# Altium schematic sheet CONTROL-LECTURA.SchDoc: CONTROL - LECTURA
size A3; ApprovedBy: ---; Author: MARIO DE MIGUEL; Engineer: MARIO DE MIGUEL; SheetNumber: 2; SheetTotal: 7; ProjectTitle: SENSACIONAL 2
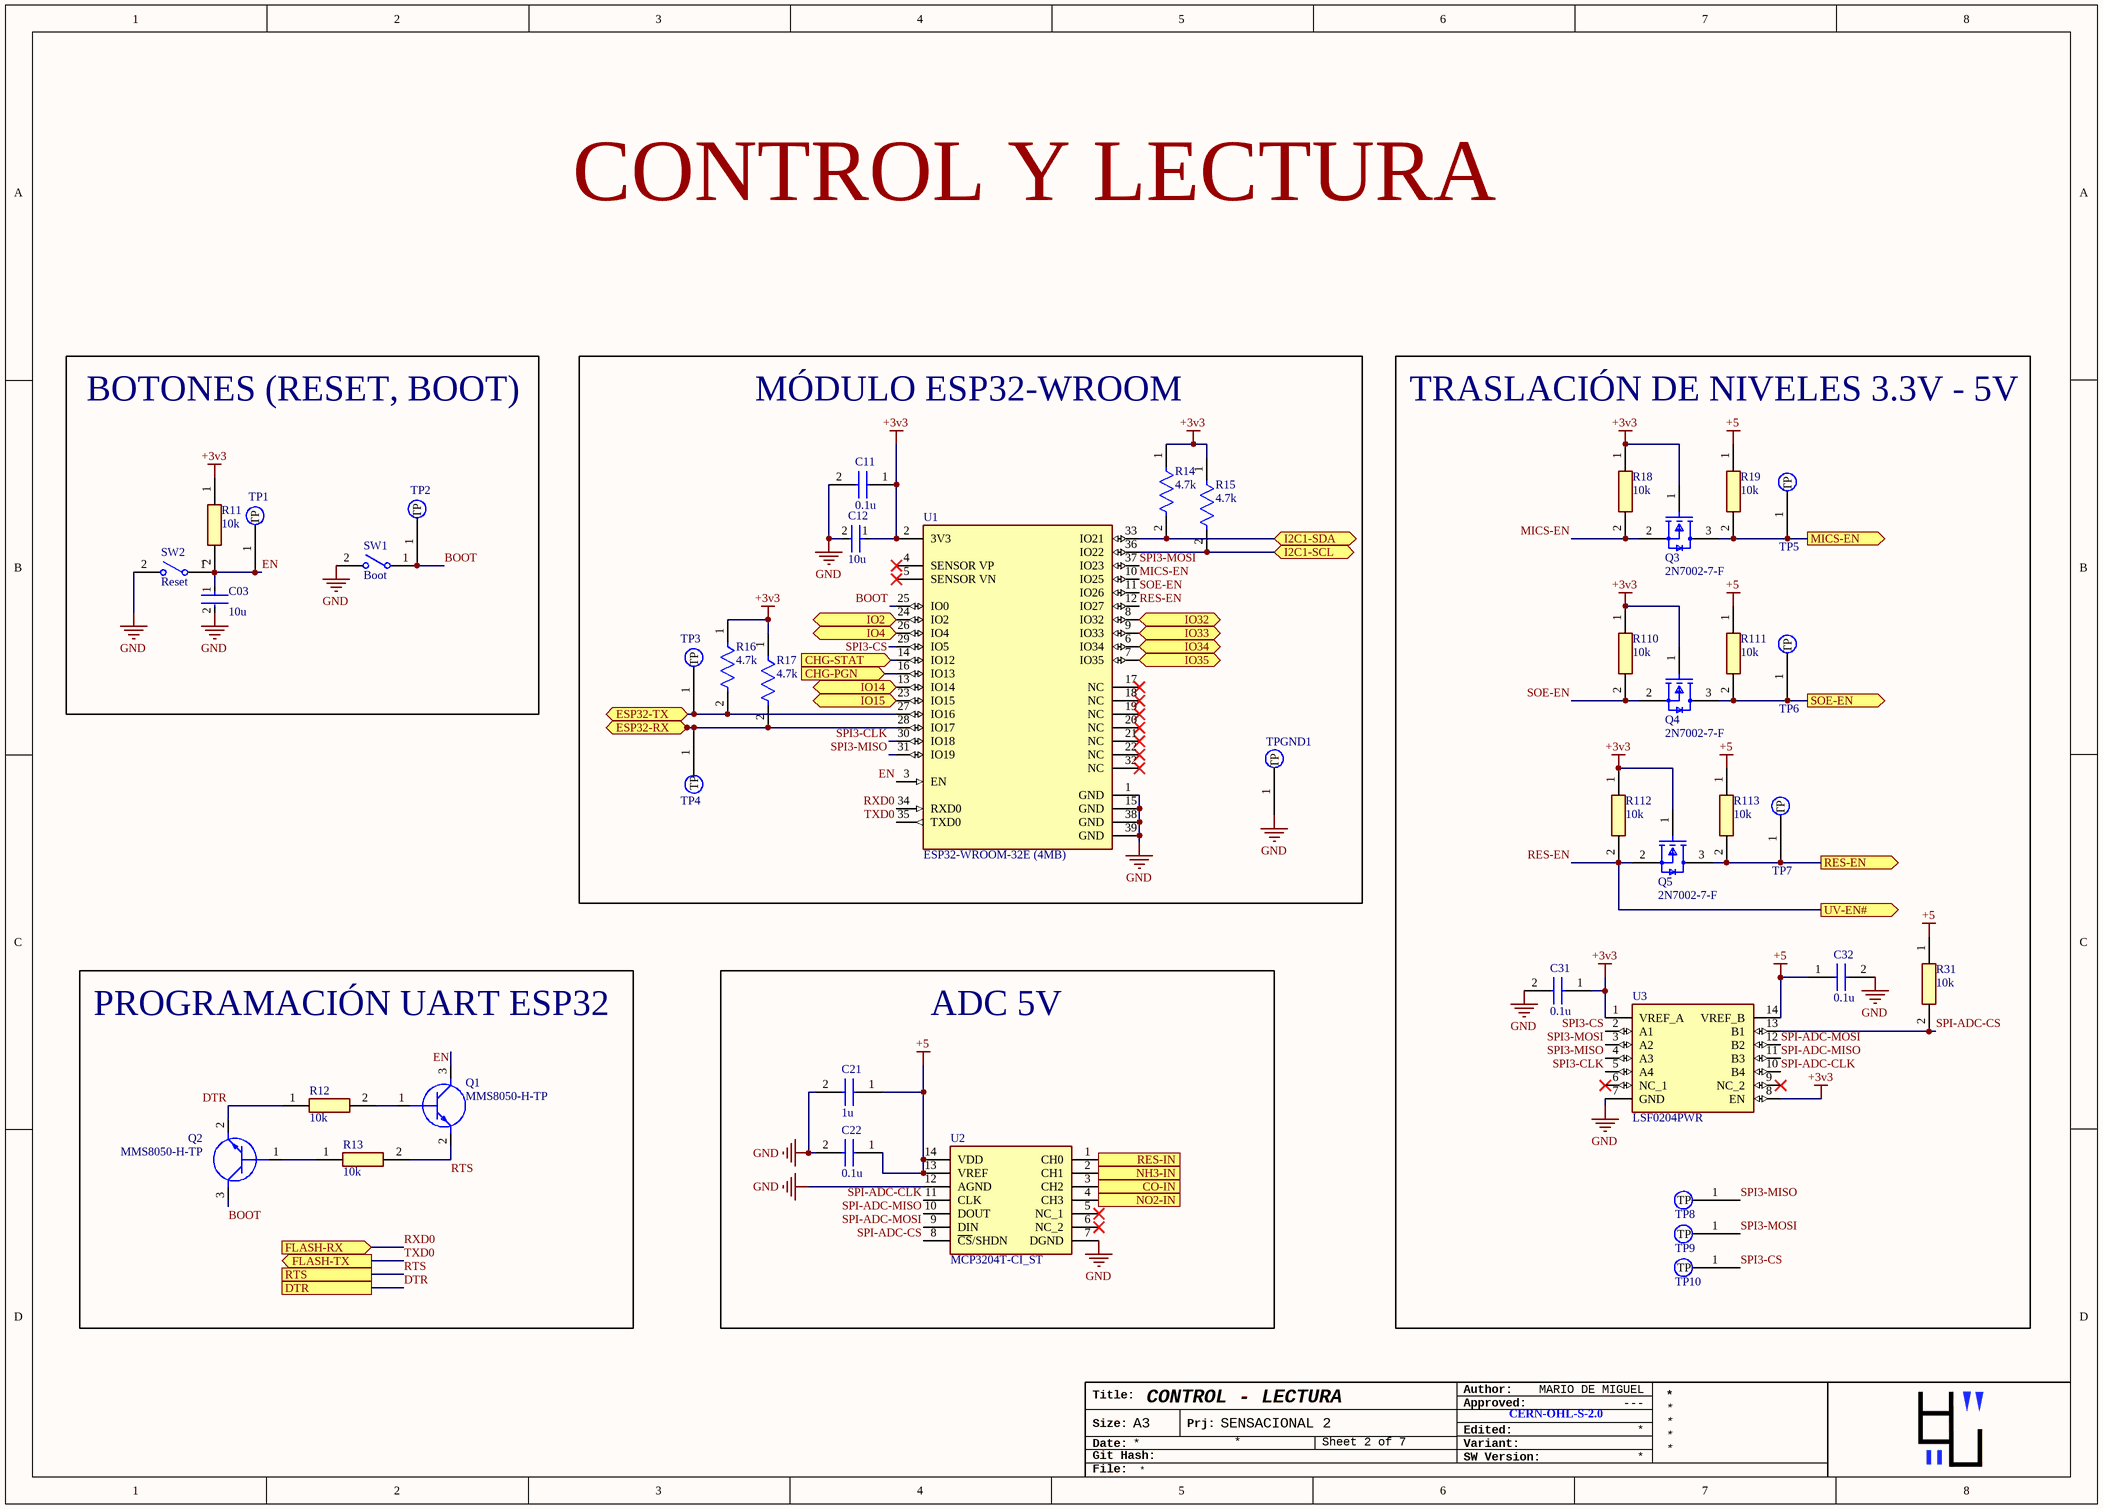
[diagram p0: CONTROL-LECTURA.SchDoc]

## Parts
C03  10u  [FP-C2012-125-0_2-MFG]
C11  0.1u  [CAPC1005X22N]
C12  10u  [FP-C2012-125-0_2-MFG]
C21  1u  [GRM15x]
C22  0.1u  [CAPC1005X22N]
C31  0.1u  [CAPC1005X22N]
C32  0.1u  [CAPC1005X22N]
Q1  MMS8050-H-TP  [SOT95P237X125-3N]
Q2  MMS8050-H-TP  [SOT95P237X125-3N]
Q3  2N7002-7-F  [FP-SOT23-MFG]
Q4  2N7002-7-F  [FP-SOT23-MFG]
Q5  2N7002-7-F  [FP-SOT23-MFG]
R11  10k  [RESC1005X40N]
R12  10k  [RESC1005X40N]
R13  10k  [RESC1005X40N]
R14  4.7k  [FP-RC0402-0_4-MFG]
R15  4.7k  [FP-RC0402-0_4-MFG]
R16  4.7k  [FP-RC0402-0_4-MFG]
R17  4.7k  [FP-RC0402-0_4-MFG]
R18  10k  [RESC1005X40N]
R19  10k  [RESC1005X40N]
R31  10k  [RESC1005X40N]
R110  10k  [RESC1005X40N]
R111  10k  [RESC1005X40N]
R112  10k  [RESC1005X40N]
R113  10k  [RESC1005X40N]
SW1  Boot  [434121025816]
SW2  Reset  [434121025816]
TP1  Testpoint  [Testpoint_TH]  (value not drawn)  (no BOM)
TP2  Testpoint  [Testpoint_TH]  (value not drawn)  (no BOM)
TP3  Testpoint  [TESTPOINT_SMD]  (value not drawn)  (no BOM)
TP4  Testpoint  [TESTPOINT_SMD]  (value not drawn)  (no BOM)
TP5  Testpoint  [Testpoint_TH]  (value not drawn)  (no BOM)
TP6  Testpoint  [Testpoint_TH]  (value not drawn)  (no BOM)
TP7  Testpoint  [Testpoint_TH]  (value not drawn)  (no BOM)
TP8  Testpoint  [TESTPOINT_SMD]  (value not drawn)  (no BOM)
TP9  Testpoint  [TESTPOINT_SMD]  (value not drawn)  (no BOM)
TP10  Testpoint  [TESTPOINT_SMD]  (value not drawn)  (no BOM)
TPGND1  Testpoint  [Testpoint_TH]  (value not drawn)  (no BOM)
U1  ESP32-WROOM-32E (4MB)  [FP-ESP32-WROOM-32E_4MB-MFG]
U2  MCP3204T-CI_ST  [SOP65P640X120-14N]
U3  LSF0204PWR  [SOP65P640X120-14N]

## Blocks framed on the sheet
BOTONES (RESET, BOOT): C03 R11 SW1 SW2 TP1 TP2
MÓDULO ESP32-WROOM: C11 C12 R14-R17 TP3 TP4 TPGND1 U1
TRASLACIÓN DE NIVELES 3.3V - 5V: C31 C32 Q3-Q5 R18 R19 R31 R110-R113 TP5-TP10 U3
PROGRAMACIÓN UART ESP32: Q1 Q2 R12 R13
ADC 5V: C21 C22 U2

## Ports
CHG-PGN (in), CHG-STAT (in), CO-IN (in), DTR, ESP32-RX (bidir), ESP32-TX (bidir), FLASH-RX (in), FLASH-TX (out), I2C1-SCL (bidir), I2C1-SDA (bidir), IO2 (bidir), IO4 (bidir), IO14 (bidir), IO15 (bidir), IO32 (bidir), IO33 (bidir), IO34 (bidir), IO35 (bidir), MICS-EN (out), NH3-IN (in), NO2-IN (in), RES-EN (out), RES-IN (in), RTS, SOE-EN (out), UV-EN# (out)

## Nets
+3v3: C11.1 C12.1 C31.1 Q3.1(G) Q4.1(G) Q5.1(G) R11.1 R14.1 R15.1 R16.1 R17.1 R18.1 R110.1 R112.1 U1.2(3V3) U3.1(VREF_A) U3.8(EN)
+5: C21.1 C22.1 C32.1 R19.1 R31.1 R111.1 R113.1 U2.13(VREF) U2.14(VDD) U3.14(VREF_B)
GND: C03.2 C11.2 C12.2 C21.2 C22.2 C31.2 C32.2 SW1.2 SW2.2 TPGND1.1(TP) U1.1(GND) U1.15(GND) U1.38(GND) U1.39(GND) U2.7(DGND) U2.12(AGND) U3.7(GND)
BOOT: Q2.3(C) SW1.1 TP2.1(TP) U1.25(IO0)
CHG-PGN: U1.16(IO13) ; port CHG-PGN
CHG-STAT: U1.14(IO12) ; port CHG-STAT
CO-IN: U2.3(CH2) ; port CO-IN
DTR: Q2.2(E) R12.1 ; port DTR
EN: C03.1 Q1.3(C) R11.2 SW2.1 TP1.1(TP) U1.3(EN)
ESP32-RX: R17.2 TP4.1(TP) U1.28(IO17) ; port ESP32-RX
ESP32-TX: R16.2 TP3.1(TP) U1.27(IO16) ; port ESP32-TX
I2C1-SCL: R15.2 U1.36(IO22) ; port I2C1-SCL
I2C1-SDA: R14.2 U1.33(IO21) ; port I2C1-SDA
IO2: U1.24(IO2) ; port IO2
IO4: U1.26(IO4) ; port IO4
IO14: U1.13(IO14) ; port IO14
IO15: U1.23(IO15) ; port IO15
IO32: U1.8(IO32) ; port IO32
IO33: U1.9(IO33) ; port IO33
IO34: U1.6(IO34) ; port IO34
IO35: U1.7(IO35) ; port IO35
MICS-EN: Q3.2(S) R18.2 U1.10(IO25)
MICS-EN: Q3.3(D) R19.2 TP5.1(TP) ; port MICS-EN  [a separate net that carries the same name]
NH3-IN: U2.2(CH1) ; port NH3-IN
NO2-IN: U2.4(CH3) ; port NO2-IN
RES-EN: Q5.2(S) R112.2 U1.12(IO27) ; port UV-EN#
RES-EN: Q5.3(D) R113.2 TP7.1(TP) ; port RES-EN  [a separate net that carries the same name]
RES-IN: U2.1(CH0) ; port RES-IN
RTS: Q1.2(E) R13.2 ; port RTS
RXD0: U1.34(RXD0) ; port FLASH-RX
SOE-EN: Q4.2(S) R110.2 U1.11(IO26)
SOE-EN: Q4.3(D) R111.2 TP6.1(TP) ; port SOE-EN  [a separate net that carries the same name]
SPI3-CLK: U1.30(IO18) U3.5(A4)
SPI3-CS: TP10.1(TP) U1.29(IO5) U3.2(A1)
SPI3-MISO: TP8.1(TP) U1.31(IO19) U3.4(A3)
SPI3-MOSI: TP9.1(TP) U1.37(IO23) U3.3(A2)
SPI-ADC-CLK: U2.11(CLK) U3.10(B4)
SPI-ADC-CS: R31.2 U2.8(~{CS}/SHDN) U3.13(B1)
SPI-ADC-MISO: U2.10(DOUT) U3.11(B3)
SPI-ADC-MOSI: U2.9(DIN) U3.12(B2)
TXD0: U1.35(TXD0) ; port FLASH-TX
NetQ1_1: Q1.1(B) R12.2
NetQ2_1: Q2.1(B) R13.1

Not connected (* = marked no-connect by the designer): U1 4(SENSOR_VP)* 5(SENSOR_VN)* 17(NC)* 18(NC)* 19(NC)* 20(NC)* 21(NC)* 22(NC)* 32(NC)*; U2 5(NC_1)* 6(NC_2)*; U3 6(NC_1)* 9(NC_2)*

## Notes on the sheet
- CONTROL Y LECTURA
- Title:
- Author:
- Approved:
- Size:
- Date:
- Git Hash:
- A3
- Prj:
- SW Version:
- Variant:
- Edited:
- CERN-OHL-S-2.0
- File:

## Library data of the parts
C03 C12 = CMP-2000-05452-2: Multilayer Ceramic Capacitors 10μF ±10% 10V X7R SMD 0805; Capacitance: 10uF; Series: C; Case/Package: 0805; REACH SVHC: No SVHC; Tolerance: 10%; Resistor Type: Ceramic; Termination: SMD/SMT; Weight: 0.000194oz; Depth: 1.25mm; Construction: Flat; RoHS Compliant: Yes; Contact Plating: Tin; Packaging: Tape and Reel; Mount: Surface Mount; Thickness: 0.057inch; Radiation Hardening: No; Dielectric: X7R; Min Operating Temperature: -55°C; Voltage Rating (DC): 10V; Voltage: 10V; Width: 0.049inch; Package Quantity: 1; Number of Pins: 2; Height: 1.25mm; Max Operating Temperature: 125°C; Dielectric Material: Ceramic; Case Code (Imperial): 0805; Lead Free: Lead Free; Voltage Rating: 10V; Case Code (Metric): 2012; Length: 2mm
C11 C22 C31 C32 = GRM152R61A104KE19D: Capacitor; Manufacturer_Name: Murata Electronics; Datasheet Link: https://search.murata.co.jp/Ceramy/image/img/A01X/G101/ENG/GRM152R61A104KE19-01A.pdf; Height: 0.22mm; Manufacturer_Part_Number: GRM152R61A104KE19D; Mouser Part Number: 81-GRM152R61A104KE9D; Mouser Price/Stock: https://www.mouser.co.uk/ProductDetail/Murata-Electronics/GRM152R61A104KE19D?qs=IPQhFcwEUOjgOs7G%2Fz457g%3D%3D; Arrow Part Number: GRM152R61A104KE19D; Arrow Price/Stock: https://www.arrow.com/en/products/grm152r61a104ke19d/murata-manufacturing
C21 = GRM155C71C105ME11J: Capacitor; Manufacturer_Name: Murata Electronics; Datasheet Link: https://search.murata.co.jp/Ceramy/image/img/A01X/G101/ENG/GRM155C71C105ME11-01A.pdf; Height: 0.33mm; Manufacturer_Part_Number: GRM155C71C105ME11J
Q1 Q2 = MMS8050-H-TP: Transistor BJT NPN; Manufacturer_Name: MCC; Datasheet Link: https://www.mccsemi.com/pdf/Products/MMS8050(SOT-23).pdf; Height: 1.25mm; Manufacturer_Part_Number: MMS8050-H-TP; Mouser Part Number: 833-MMS8050-H-TP; Mouser Price/Stock: https://www.mouser.co.uk/ProductDetail/Micro-Commercial-Components-MCC/MMS8050-H-TP?qs=y6ZabgHbY%252Bwohxnqwm2Wtw%3D%3D; Arrow Part Number: MMS8050-H-TP; Arrow Price/Stock: https://www.arrow.com/en/products/mms8050-h-tp/micro-commercial-components?utm_currency=USD&region=nac
Q3-Q5 = CMP-2000-04929-2: MOSFET N-CH 60V 115MA SOT23-3; Turn-On Delay Time: 7ns; Turn-Off Delay Time: 11ns; Drain to Source Resistance: 7.5R; Rise Time: 3ns; Drain to Source Breakdown Voltage: 70V; Input Capacitance: 50pF; Number of Elements: 1; Power Dissipation: 540mW; Max Power Dissipation: 300mW; Fall Time: 5.6ns; Gate to Source Voltage (Vgs): 20V; Threshold Voltage: 2.5V; Element Configuration: Single; Termination: SMD/SMT; Weight: 0.000282oz; Radiation Hardening: No; Max Operating Temperature: 150°C; On-State Resistance: 7.5R; Mount: Surface Mount; Current Rating: 115mA; Contact Plating: Tin; Lead Free: Lead Free; Min Operating Temperature: -55°C; Number of Pins: 3; REACH SVHC: No SVHC; Drain to Source Voltage (Vdss): 60V; Width: 1.3mm; Package Quantity: 3000; Length: 2.9mm; Case/Package: SOT-23; Number of Channels: 1; Dual Supply Voltage: 60V; Packaging: Tape and Reel; Height: 1mm; Voltage Rating (DC): 60V; Nominal Vgs: 2.5V; Continuous Drain Current (ID): 115mA; Voltage: 60V; Rds On Max: 7.5R
R11-R13 R18 R19 R31 R110-R113 = RCA040210K0JNED: Resistor; Manufacturer_Name: Vishay; Datasheet Link: https://www.vishay.com/docs/20037/rcae3.pdf; Height: 0.4mm; Manufacturer_Part_Number: RCA040210K0JNED; Mouser Part Number: 71-RCA040210K0JNED; Mouser Price/Stock: https://www.mouser.co.uk/ProductDetail/Vishay-Draloric/RCA040210K0JNED?qs=MG8z16zmaH46yN0G7Zhn3Q%3D%3D; Arrow Part Number: RCA040210K0JNED; Arrow Price/Stock: https://www.arrow.com/en/products/rca040210k0jned/vishay?region=nac
R14-R17 = CMP-2002-08011-2: Tolerance: 5%; Power Rating: 63mW; Resistance: 4.7kΩ; Voltage Rating: 50V; Temperature Coefficient: 100ppm/°C; Composition: Thick Film; Max Operating Temperature: 155°C; Case/Package: 0402; Depth: 500µm; Packaging: Tape & Reel; Number of Pins: 2; Schedule B: 8533210045, 8533210045; Case Code (Imperial): 0402; Termination: SMD/SMT; Military Standard: Not; Lead Free: Lead Free; Width: 500µm; REACH SVHC: No SVHC; Max Power Dissipation: 63mW; Voltage Rating (AC): 50V; Features: Moisture Resistant; Min Operating Temperature: -55°C; Number of Terminations: 2; RoHS: Compliant; Height: 350µm; Voltage Rating (DC): 50V; Length: 1mm
SW1 SW2 = CMP-1459-00004-3: Switch Tactile Spst-no 0.05A 12V; Operating Force: 1.56N; Contact Resistance: 100mΩ; Switch Function: Off-Mom; Mechanical Life: 50kcycles; Switch Travel: 250µm; Actuator Material: Liquid Crystal Polymer, Polymer; Current Rating: 50mA; Throw Configuration: SPST; Actuator Length: 800µm; Illumination Type: Illuminated, Non-Illuminated; Color: Black; Height: 2.5mm; Contact Material: Stainless Steel, Steel; Voltage Rating: 12V; Packaging: Tape and Reel; Contact Plating: Silver; Max Operating Temperature: 85°C; RoHS: Compliant; Lead Free: Lead Free; Termination: SMD/SMT; REACH SVHC: No SVHC; Mount: Surface Mount; Min Operating Temperature: -40°C; Length: 7.3mm; Insulation Resistance: 100MΩ; Contact Current Rating: 50mA
U1 = CMP-194065-000026-1: RX TXRX MOD WIFI TRACE ANT SMD
U2 = MCP3204T-CI_ST: Integrated Circuit; Manufacturer_Name: Microchip; Manufacturer_Part_Number: MCP3204T-CI/ST; Datasheet Link: https://www.mouser.com/datasheet/2/268/21298e-3135724.pdf; Height: 1.2mm; Mouser Part Number: 579-MCP3204T-CI/ST; Mouser Price/Stock: https://www.mouser.co.uk/ProductDetail/Microchip-Technology/MCP3204T-CI-ST?qs=Sez7gRs8XSU3Z353RdBbSg%3D%3D; Arrow Part Number: MCP3204T-CI/ST; Arrow Price/Stock: https://www.arrow.com/en/products/mcp3204t-cist/microchip-technology?utm_currency=USD&region=nac
U3 = LSF0204PWR: Integrated Circuit; Manufacturer_Name: Texas Instruments; Datasheet Link: http://www.ti.com/lit/gpn/lsf0204; Height: 1.2mm; Manufacturer_Part_Number: LSF0204PWR; Mouser Part Number: 595-LSF0204PWR; Mouser Price/Stock: https://www.mouser.co.uk/ProductDetail/Texas-Instruments/LSF0204PWR?qs=m%2F7bTylgptck0MkFZrWcVg%3D%3D; Arrow Part Number: LSF0204PWR; Arrow Price/Stock: https://www.arrow.com/en/products/lsf0204pwr/texas-instruments?region=nac